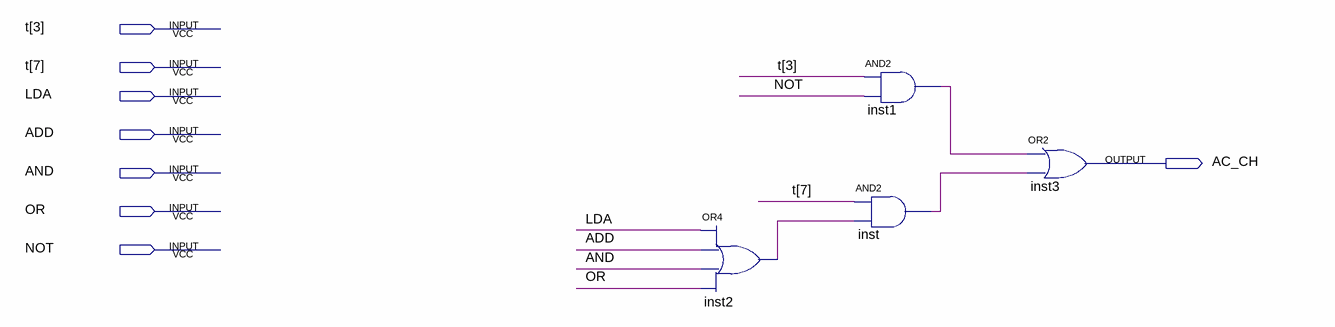
[diagram p0: schematic sheet]
// Quartus schematic AC_CH_LOGIC.bdf as structural Verilog: 4 symbols, 8 pins
module AC_CH_LOGIC (
  input  [7:3] t,
  input  LDA,
  input  ADD,
  input  AND,
  input  OR,
  input  NOT,
  output AC_CH
);

  wire inst1_out, inst2_out, inst_out;

  or inst2 (inst2_out, LDA, ADD, AND, OR);
  and inst1 (inst1_out, t[3], NOT);
  and inst (inst_out, t[7], inst2_out);
  or inst3 (AC_CH, inst1_out, inst_out);
endmodule
